# Altium project hexbot_气体传感器.PrjPcb
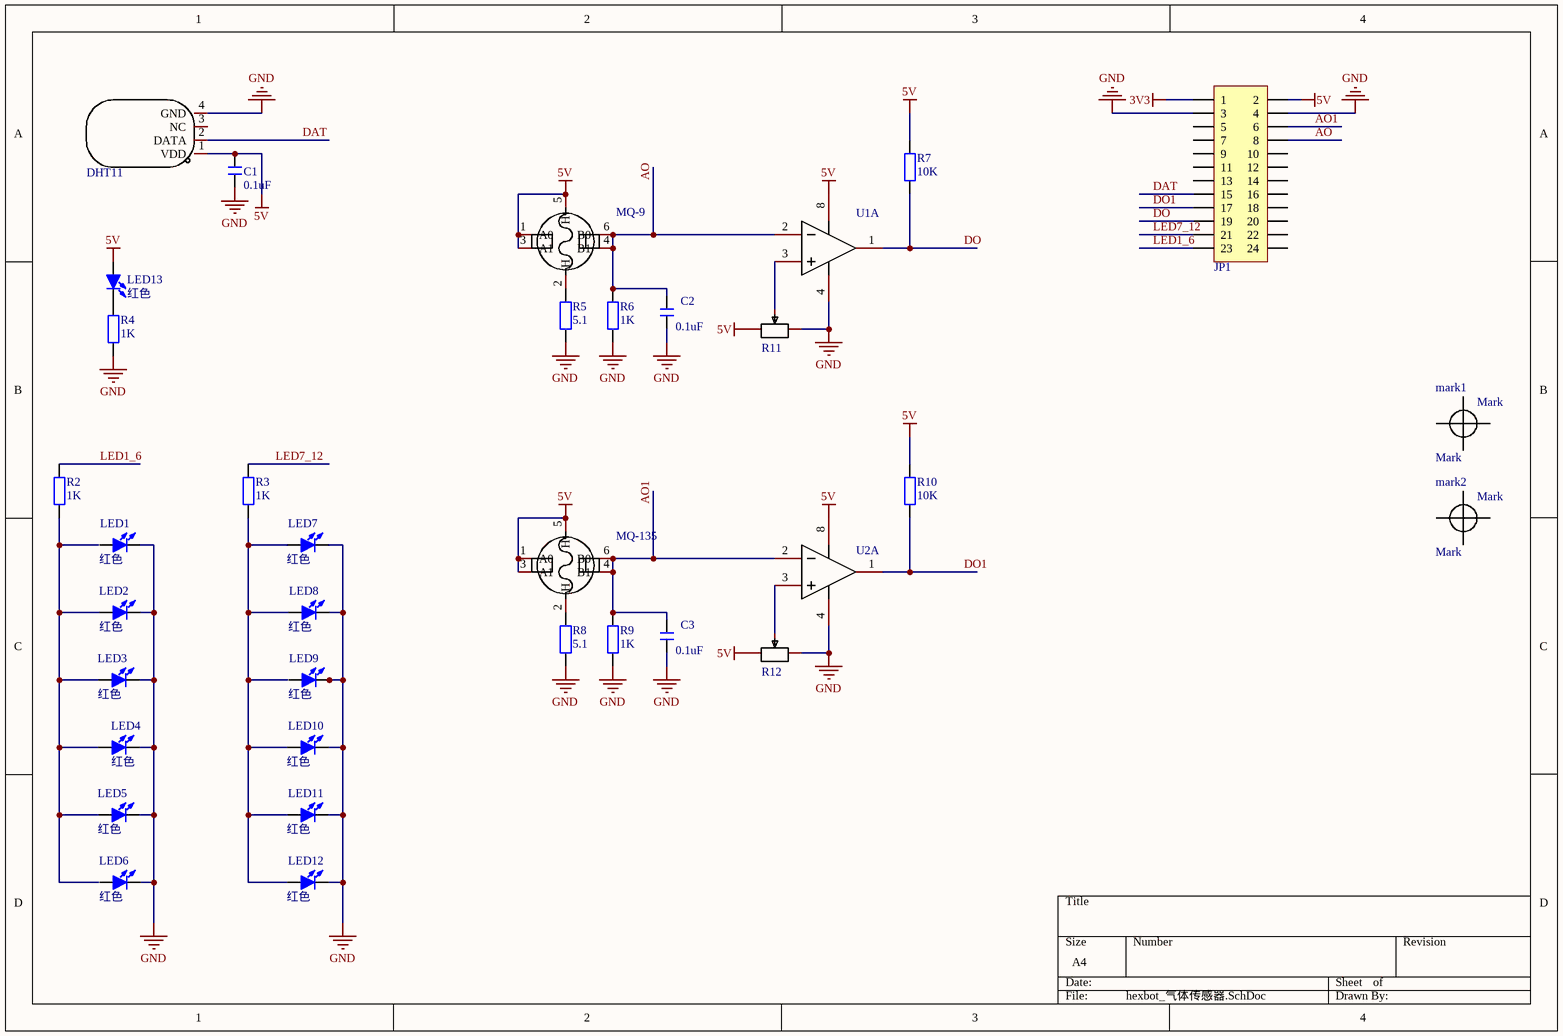
[diagram p0: hexbot_气体传感器.SchDoc]
1 sheet, 35 parts. Net scope: global (net labels, ports and power ports of the same name join across sheets).
Board file: hexbot_气体传感器.PcbDoc

## Sheet hexbot_气体传感器.SchDoc
size A4

### Parts
C1  0.1uF  [C 0603_L]
C2  0.1uF  [C 0603_L]
C3  0.1uF  [C 0603_L]
DHT11  DHT11  [DHT11]  (value not drawn)
JP1  Header 2X11  [HDR2.54-WI-2x12P]  (value not drawn)
LED1  红色  [LED 0603R]
LED2  红色  [LED 0603R]
LED3  红色  [LED 0603R]
LED4  红色  [LED 0603R]
LED5  红色  [LED 0603R]
LED6  红色  [LED 0603R]
LED7  红色  [LED 0603R]
LED8  红色  [LED 0603R]
LED9  红色  [LED 0603R]
LED10  红色  [LED 0603R]
LED11  红色  [LED 0603R]
LED12  红色  [LED 0603R]
LED13  红色  [LED 0603R]
mark1  Mark  [Mark]  (no BOM)
mark2  Mark  [Mark]  (no BOM)
MQ-9  MQ-9  [MQ]  (value not drawn)
MQ-135  MQ-9  [MQ]  (value not drawn)
R2  1K  [R 0603_L]
R3  1K  [R 0603_L]
R4  1K  [R 0603_L]
R5  5.1  [R 0603_L]
R6  1K  [R 0603_L]
R7  10K  [R 0603_L]
R8  5.1  [R 0603_L]
R9  1K  [R 0603_L]
R10  10K  [R 0603_L]
R11  RM065-V1-103  [RM065]  (value not drawn)
R12  RM065-V1-103  [RM065]  (value not drawn)
U1  LM393  [LM393]  (value not drawn)  (part A of 2)
U2  LM393  [LM393]  (value not drawn)  (part A of 2)

### Nets
3V3: JP1.1
5V: C1.2 DHT11.1(VDD) JP1.2 LED13.1(A) MQ-9.1(A0) MQ-9.3(A1) MQ-9.5(H) MQ-135.1(A0) MQ-135.3(A1) MQ-135.5(H) R7.2 R10.2 R11.1 R12.1 U1.8(VCC) U2.8(VCC)
GND: C1.1 C2.1 C3.1 DHT11.4(GND) JP1.3 JP1.4 LED1.2(K) LED2.2(K) LED3.2(K) LED4.2(K) LED5.2(K) LED6.2(K) LED7.2(K) LED8.2(K) LED9.2(K) LED10.2(K) LED11.2(K) LED12.2(K) R4.1 R5.1 R6.1 R8.1 R9.1 R11.3 R12.3 U1.4(GND) U2.4(GND)
AO: C2.2 JP1.8 MQ-9.4(B1) MQ-9.6(B0) R6.2 U1.2(INA-)
AO1: C3.2 JP1.6 MQ-135.4(B1) MQ-135.6(B0) R9.2 U2.2(INA-)
DAT: DHT11.2(DATA) JP1.15
DO: JP1.19 R7.1 U1.1(OUTA)
DO1: JP1.17 R10.1 U2.1(OUTA)
LED1_6: JP1.23 R2.2
LED7_12: JP1.21 R3.2
NetLED2_1: LED2.1(A) LED3.1(A) LED4.1(A) LED5.1(A) R2.1
NetLED7_1: LED7.1(A) LED8.1(A) LED10.1(A) LED11.1(A) LED12.1(A) R3.1
NetLED13_2: LED13.2(K) R4.2
NetMQ-9_2: MQ-9.2(H) R5.2
NetMQ-135_2: MQ-135.2(H) R8.2
NetR11_2: R11.2 U1.3(INA+)
NetR12_2: R12.2 U2.3(INA+)

Not connected (* = marked no-connect by the designer): DHT11 3(NC); JP1 5 7 9 10 11 12 13 14 16 18 20 22 24; LED1 1(A); LED6 1(A); LED9 1(A)

### Library data of the parts
C1-C3 = C: 贴片电容; BOM名称: 无极性贴片电容; 淘宝ID: 封装库来自淘宝 ID：黄晶宝石; 联系售后，技术支持: https://shop463601444.taobao.com; 唯一出售店铺网址: https://shop463601444.taobao.com
DHT11 = DHT11: 传感器类型:Humidity, Temperature;输出类型:-;温度范围:-;湿度范围:-;精度:-;; Manufacturer: 广州奥松; Add into BOM: yes; Voltage-Supply: 3.3 V ~ 5.5 V; Symbol: DHT11; Device: DHT11; LCSC Part Name: DHT11  电容式传感器; Supplier Part: C117051; Manufacturer Part: DHT11; Supplier Footprint: 16.1mm*12.6mm*5.8mm; JLCPCB Part Class: Extended Part; Datasheet: https://atta.szlcsc.com/upload/public/pdf/source/20170703/1499081238365.pdf; Supplier: LCSC; Convert to PCB: yes; Sensor Type: Humidity, Temperature; Output Type: -; Temperature Range: -; Humidity Range: -; Response Time: -; Accuracy: -; Operating Temperature: -
JP1 = Header 12X2: 12*2P接插件; 版权归属: 封装库来自淘宝卖家 ID：黄晶宝石; BOM名称: 12*2P接插件; 学习资源: https://shop463601444.taobao.com
LED1-LED13 = LED-SMD: 贴片LED; 版权归属: 封装库来自淘宝 ID：黄晶宝石; BOM名称: 贴片LED; 学习资源: https://shop463601444.taobao.com
MQ-9 MQ-135 = MQ-4: MQ-4天燃气检测传感器，与MQ-2特性; Manufacturer: Winsen(炜盛); Add into BOM: yes; Symbol: MQ-4; Device: MQ-4; LCSC Part Name: MQ-4; Supplier Part: C99756; Manufacturer Part: MQ-4; Supplier Footprint: Through Hole; JLCPCB Part Class: Extended Part; Datasheet: https://atta.szlcsc.com/upload/public/pdf/source/20170327/1490588065885.pdf; Supplier: LCSC; Convert to PCB: yes
R2-R10 = R: 贴片电阻; 版权归属: 来自淘宝 ID：黄晶宝石; 封装库来自淘宝卖家 ID：黄晶宝石: 其他店铺购入均为盗版，不享受售后技术支持服务，请立即申请退款; BOM名称: 贴片电阻; 联系售后: https://shop463601444.taobao.com
R11 R12 = RM065-V1-103: 精度:±20%;; Add into BOM: yes; NAME: 2; Symbol: RM065-V1-103; Device: RM065-V1-103; LCSC Part Name: RM065-V1-103; Supplier Part: C54661; Manufacturer Part: RM065-V1-103; Supplier Footprint: 蓝白卧式可调插件; JLCPCB Part Class: Extended Part; Datasheet: https://atta.szlcsc.com/upload/public/pdf/source/20151026/1457707505827.pdf; Supplier: LCSC; Convert to PCB: yes; NUMBER: 2
U1 U2 = LM393: 比较器组数:-;电源电压:-;各通道供电电流:-;输出类型:-;传播延迟:-;; Manufacturer: IDCHIP(英锐芯); Symbol: LM393_C400839; Add into BOM: yes; Device: LM393; LCSC Part Name: LM393; Supplier Part: C400839; Manufacturer Part: LM393; Supplier Footprint: SOP-8; JLCPCB Part Class: Extended Part; Datasheet: https://atta.szlcsc.com/upload/public/pdf/source/20190624/C400839_FC3E4757065A64BC24F9F0B8EF99EFFB.pdf; Supplier: LCSC; Convert to PCB: yes; Number of Elements: -; Supply Voltage（Single）: -; Iq per channel (Typ): -; Output Type: -; Propagation Delay (Max): -; Operating Temperature: -